# EAGLE design stripboard (EAGLE 6.1)
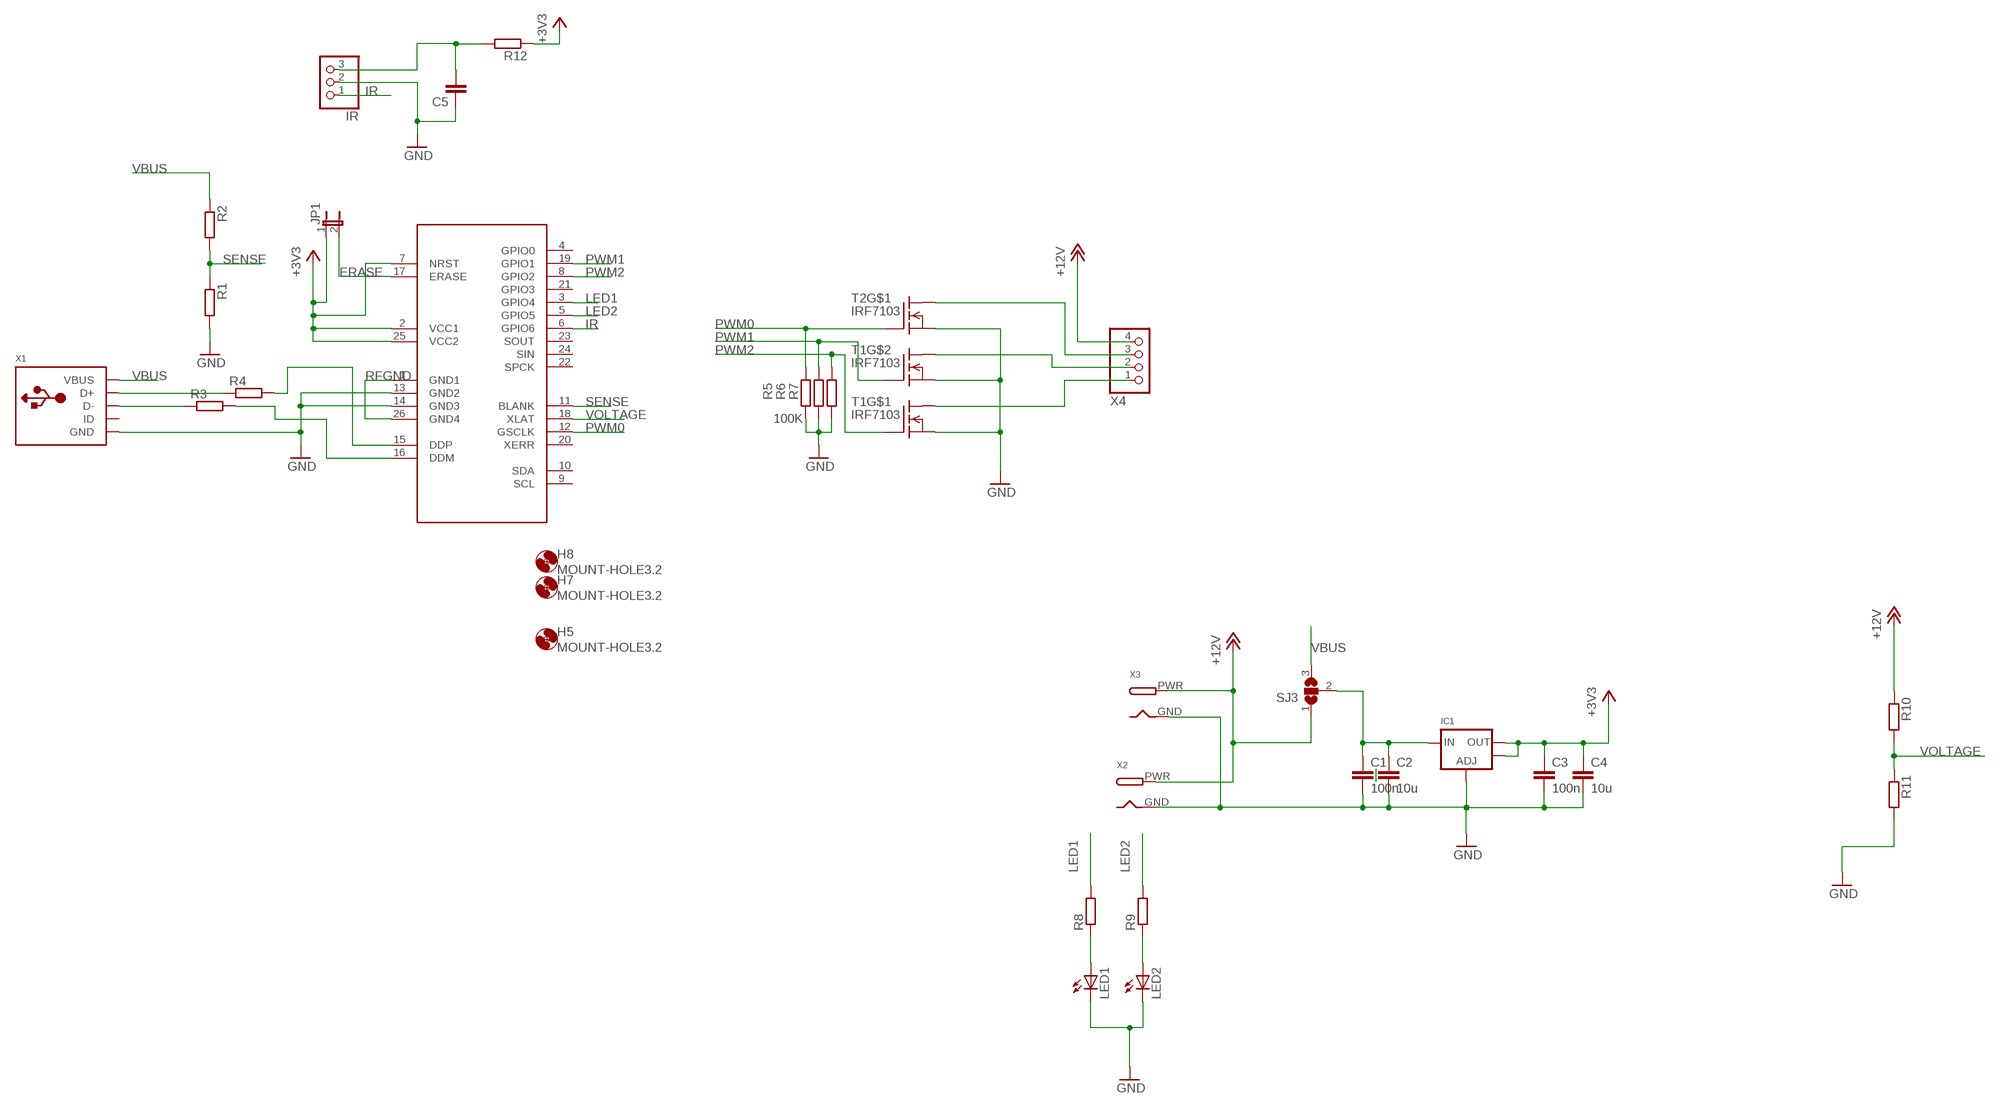
[diagram p0: schematic, sheet 1]

## Parts
C1  100n  C-EUC0805  [C0805]
C2  10u  C-EUC0805  [C0805]
C3  100n  C-EUC0805  [C0805]
C4  10u  C-EUC0805  [C0805]
C5  C-EUC0805  [C0805]
H5  MOUNT-HOLE3.2  [3,2]
H7  MOUNT-HOLE3.2  [3,2]
H8  MOUNT-HOLE3.2  [3,2]
IC1  LM1117SOT223-REFLOW  [SOT223-R]
IR  PINHD-1X3  [1X03]
JP1  JP1E  [JP1]
LED1  LEDCHIP-LED0805  [CHIP-LED0805]
LED2  LEDCHIP-LED0805  [CHIP-LED0805]
R1  R-EU_R0805  [R0805]
R2  R-EU_R0805  [R0805]
R3  R-EU_R0805  [R0805]
R4  R-EU_R0805  [R0805]
R5  100K  R-EU_M0805  [M0805]
R6  100K  R-EU_M0805  [M0805]
R7  100K  R-EU_M0805  [M0805]
R8  R-EU_R0805  [R0805]
R9  R-EU_R0805  [R0805]
R10  R-EU_R0805  [R0805]
R11  R-EU_R0805  [R0805]
R12  R-EU_R0805  [R0805]
SJ3  SJ2W  [SJ_2]
T1  IRF7103  [SO-8]
T2  IRF7103  [SO-8]
U$1  RFBOARD  [RFBOARD]
X1  USBMINIB  [USB-MINIB]
X2  DCBARRELPTH  [DCJACK_2MM_PTH]
X3  DCBARRELPTH  [DCJACK_2MM_PTH]
X4  PINHD-1X4/90  [1X04/90]

## Nets
+3V3: C3.1 C4.1 IC1.2(OUT) IC1.4(OUT1) JP1.1 R12.1 U$1.2(VCC1) U$1.7(NRST) U$1.25(VCC2)
+12V: R10.1 SJ3.1 X2.PWR X3.PWR X4.4
ERASE: JP1.2 U$1.17(ERASE)
GND: C1.2 C2.2 C3.2 C4.2 C5.1 IC1.1(ADJ) IR.2 LED1.C LED2.C R1.2 R5.2 R6.2 R7.2 R11.2 T1.1(S) T1.3(S) T2.1(S) U$1.13(GND2) U$1.14(GND3) X1.GND X2.GND X3.GND
IR: IR.1 U$1.6(GPIO6)
LED1: R8.2 U$1.3(GPIO4)
LED2: R9.2 U$1.5(GPIO5)
N$1: T1.8(D1) X4.1
N$4: T1.5(D1) X4.2
N$5: T2.8(D1) X4.3
N$47: LED1.A R8.1
N$48: LED2.A R9.1
N$49: R3.2 U$1.16(DDM)
N$55: R4.2 U$1.15(DDP)
N$60: R4.1 X1.D+
N$61: C1.1 C2.1 IC1.3(IN) SJ3.2
N$62: R3.1 X1.D-
N$65: C5.2 IR.3 R12.2
PWM0: R5.1 T2.2(G) U$1.12(GSCLK)
PWM1: R6.1 T1.4(G) U$1.19(GPIO1)
PWM2: R7.1 T1.2(G) U$1.8(GPIO2)
RFGND: U$1.1(GND1) U$1.26(GND4)
SENSE: R1.1 R2.2 U$1.11(BLANK)
VBUS: R2.1 SJ3.3 X1.VBUS
VOLTAGE: R10.2 R11.1 U$1.18(XLAT)
Unconnected: T1.6(D) T1.7(D) T2.3(S) T2.4(G) T2.5(D1) T2.6(D) T2.7(D) U$1.4(GPIO0) U$1.9(SCL) U$1.10(SDA) U$1.20(XERR) U$1.21(GPIO3) U$1.22(SPCK) U$1.23(SOUT) U$1.24(SIN) X1.ID

## Library data of the parts
C1-C5 = rcl:C-EU: CAPACITOR, European symbol
H5 H7 H8 = holes:MOUNT-HOLE: MOUNTING HOLE with drill center marker
IC1 = xtort:LM1117: LM1117 Voltage Regulator LM1117 Adjustable Voltage regulator [Digikey: LM1117IMP-ADJDKR-ND] LM1117 3.3V Voltage regulator [AP1117E33GDIDKR-ND] LM1117 5.0V Voltage regulator [AP1117E50GDIDKR-ND] SOT223-REFLOW - SOT223 package for solder paste/reflow ovens SOT223-WAVE - SOT223 package for hand-soldering (larger pads) Note: For the fixed-voltage regulators, simply set the ADJ pin to GND.
IR = pinhead:PINHD-1X3: PIN HEADER
JP1 = jumper:JP1E: JUMPER
LED1 LED2 = led:LED: LED OSRAM: - CHIPLED LG R971, LG N971, LY N971, LG Q971, LY Q971, LO R971, LY R971 LH N974, LH R974 LS Q976, LO Q976, LY Q976 LO Q996 - Hyper CHIPLED LW Q18S LB Q993, LB Q99A, LB R99A - SideLED LS A670, LO A670, LY A670, LG A670, LP A670 LB A673, LV A673, LT A673, LW A673 LH A674 LY A675 LS A676, LA A676, LO A676, LY A676, LW A676 LS A679, LY A679, LG A679 - Hyper Micro SIDELED® LS Y876, LA Y876, LO Y876, LY Y876 LT Y87S - SmartLED LW L88C, LW L88S LB L89C, LB L89S, LG L890 LS L89K, LO L89K, LY L89K LS L896, LA L896, LO L896, LY L896 - TOPLED LS T670, LO T670, LY T670, LG T670, LP T670 LSG T670, LSP T670, LSY T670, LOP T670, LYG T670 LG T671, LOG T671, LSG T671 LB T673, LV T673, LT T673, LW T673 LH T674 LS T676, LA T676, LO T676, LY T676, LB T676, LH T676, LSB T676, LW T676 LB T67C, LV T67C, LT T67C, LS T67K, LO T67K, LY T67K, LW E67C LS E67B, LA E67B, LO E67B, LY E67B, LB E67C, LV E67C, LT E67C LW T67C LS T679, LY T679, LG T679 LS T770, LO T770, LY T770, LG T770, LP T770 LB T773, LV T773, LT T773, LW T773 LH T774 LS E675, LA E675, LY E675, LS T675 LS T776, LA T776, LO T776, LY T776, LB T776 LHGB T686 LT T68C, LB T68C - Hyper Mini TOPLED® LB M676 - Mini TOPLED Santana® LG M470 LS M47K, LO M47K, LY M47K Source: http://www.osram.convergy.de LUXEON: - LUMILED® LXK2-PW12-R00, LXK2-PW12-S00, LXK2-PW14-U00, LXK2-PW14-V00 LXK2-PM12-R00, LXK2-PM12-S00, LXK2-PM14-U00 LXK2-PE12-Q00, LXK2-PE12-R00, LXK2-PE12-S00, LXK2-PE14-T00, LXK2-PE14-U00 LXK2-PB12-K00, LXK2-PB12-L00, LXK2-PB12-M00, LXK2-PB14-N00, LXK2-PB14-P00, LXK2-PB14-Q00 LXK2-PR12-L00, LXK2-PR12-M00, LXK2-PR14-Q00, LXK2-PR14-R00 LXK2-PD12-Q00, LXK2-PD12-R00, LXK2-PD12-S00 LXK2-PH12-R00, LXK2-PH12-S00 LXK2-PL12-P00, LXK2-PL12-Q00, LXK2-PL12-R00 Source: www.luxeon.com KINGBRIGHT: KA-3528ASYC Source: www.kingbright.com
R1-R12 = rcl:R-EU_: RESISTOR, European symbol
SJ3 = jumper:SJ2W: SMD solder JUMPER
T1 T2 = transistor-fet+irf7201:IRF7103
U$1 = xtort:RFBOARD
X1 = xtort:USB: USB Connectors USBMINIB - Surface Mount Female Mini-B USB Connector 4UConnector: 06564
X2 X3 = xtort:DCBARREL: DC Barrel Jack DCJACK_1.3MM_PTH - Through Hole 1.3mm Jack (4UConnector: 05536) DCJACK_2MM_PTH - Through Hole 2.0/2.1 Jack (4UConnector: 05537) DCJACK_2MM_SMT - SMT 2.0/2.1mm Jack(4UConnector: 03267)
X4 = pinhead:PINHD-1X4: PIN HEADER

## Board
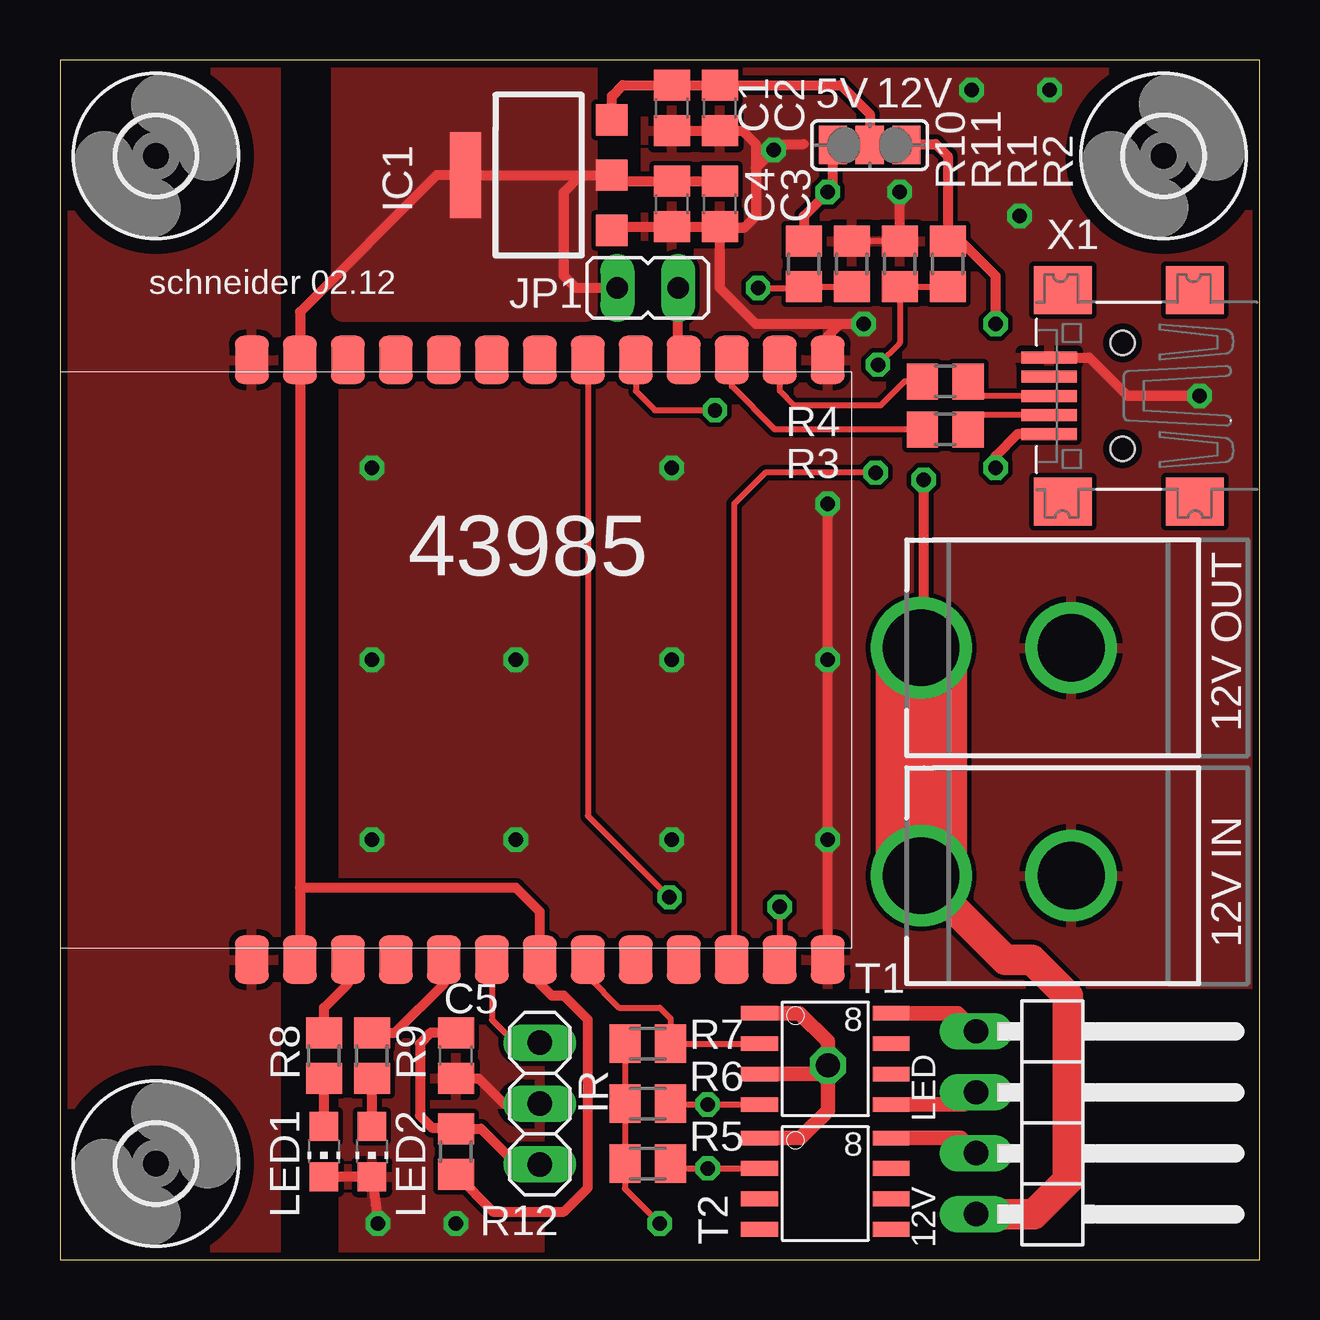
[diagram p1: board, top side]
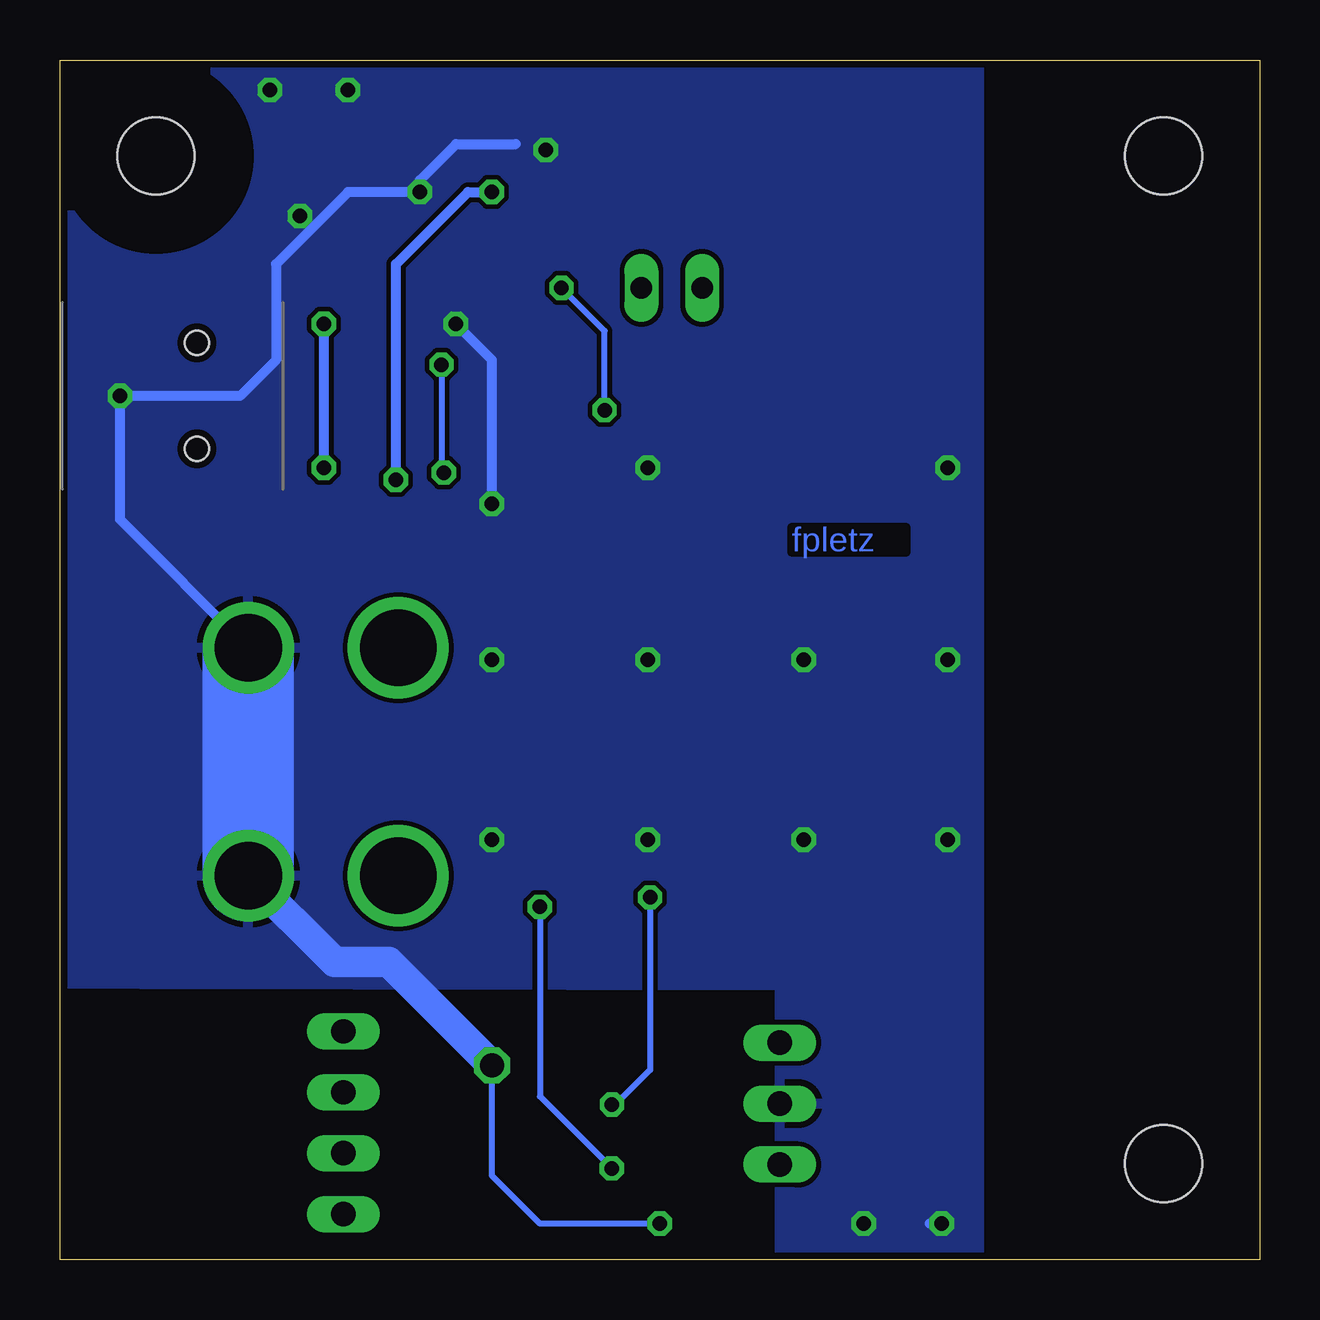
[diagram p2: board, bottom side, seen from below]

Size 50 x 50 mm. Coordinates in mm from the lower left corner, seen from the top.
Outline: 0,0 50,0 50,50 0,50 0,0
Copper layers (1*16): Top 0.035mm / dielectric 1.5mm / Bottom 0.035mm
Design rules: minimum track width 0.2mm, minimum drill 0.3mm, track to track 0.2mm, track to pad 0.2mm, pad to pad 0.2mm, via to via 0.2mm, smd to smd 0.2mm, copper to edge 0.3mm, drill to drill 8mil, minimum pad ring 10mil, minimum via ring 8mil, stop-mask expansion 4mil, vias tented up to drill 0.6mm, thermal gap 10mil

### Footprints (pad centres in the part's own frame; a part is rotated, then mirrored left to right if it is on the bottom)
C0805 = smd 1.3 x 1.5: 1 -0.95,0; 2 0.95,0
3,2 = hole 3.2: 0,0
SOT223-R = smd 1.3 x 1.3: 1 -2.3,-3.05; 2 0,-3.05; 3 2.3,-3.05 | smd 3.6 x 1.3: 4 0,3.05
1X03 = drill 1.016 long: 1 -2.54,0; 2 0,0; 3 2.54,0
JP1 = drill 0.914 long: 1 0,-1.27; 2 0,1.27
CHIP-LED0805 = smd 1.2 x 1.2: A 0,-1.05; C 0,1.05
R0805 = smd 1.3 x 1.5: 1 -0.95,0; 2 0.95,0
M0805 = smd 1.3 x 1.6: 1 -0.95,0; 2 0.95,0
SJ_2 = smd 1.168 x 1.6: 1 -1.524,0; 2 0,0; 3 1.524,0
SO-8 = smd 1.524 x 0.61: 1 -2.743,1.27; 2 -2.743,0; 3 -2.743,-1.27; 4 -2.743,-2.54; 5 2.743,-2.54; 6 2.743,-1.27; 7 2.743,0; 8 2.743,1.27
RFBOARD = smd 2 x 1.4: 1 -12.5,8; 2 -12.5,6; 3 -12.5,4; 4 -12.5,2; 5 -12.5,0; 6 -12.5,-2; 7 -12.5,-4; 8 -12.5,-6; 9 -12.5,-8; 10 -12.5,-10; 11 -12.5,-12; 12 -12.5,-14; 13 -12.5,-16; 14 12.5,-16; 15 12.5,-14; 16 12.5,-12; 17 12.5,-10; 18 12.5,-8; 19 12.5,-6; 20 12.5,-4; 21 12.5,-2; 22 12.5,0; 23 12.5,2; 24 12.5,4; 25 12.5,6; 26 12.5,8
USB-MINIB = smd 0.5 x 2.308: D+ 0,4.064; D- -0.8,4.064; GND 1.6,4.064; ID 0.8,4.064; VBUS -1.6,4.064 | smd 2 x 2.4: GND1 -4.4,-2; GND2 -4.4,3.5; GND3 4.4,3.5; GND4 4.4,-2 | hole 1: -2.2,1; 2.2,1
DCJACK_2MM_PTH = drill 2.8: GND 0,7.35 | drill 3.2: PWR 0,13.6
1X04/90 = drill 1.016 long: 1 -3.81,-3.81; 2 -1.27,-3.81; 3 1.27,-3.81; 4 3.81,-3.81

### Placement (x,y rotation side)
C1  25.5,48 270 top
C2  27.5,48 270 top
C3  27.5,44 270 top
C4  25.5,44 270 top
C5  16.5,8.5 90 top
H5  4,4 0 top
H7  4,46 0 top
H8  46,46 0 top
IC1  19.95,45.2 90 top
IR  20,6.5 270 top
JP1  24.5,40.5 270 top
LED1  11,4.5 180 top
LED2  13,4.5 180 top
R1  35,41.5 90 top
R2  37,41.5 270 top
R3  36.9,34.6 180 top
R4  36.9,36.6 180 top
R5  24.5,4 180 top
R6  24.5,6.5 180 top
R7  24.5,9 180 top
R8  11,8.5 90 top
R9  13,8.5 90 top
R10  31,41.5 270 top
R11  33,41.5 90 top
R12  16.5,4.5 90 top
SJ3  33.75,46.45 0 top
T1  31.9,9 0 top
T2  31.9,3.8 0 top
U$1  16,25 90 top
X1  45.3,36 90 top
X2  49.5,25.5 90 top
X3  49.5,16 90 top
X4  42,5.7 270 top

### Tracks (layer width: path | path; a pad name or v marks a point on that pad's centre or on a via)
+3V3
  Top 0.406: R12.1 18.05,2 21,2 22,3 22,10 21,11 20.5,11 20,11.5 U$1.7 20,14.5 19,15.5 10,15.5 | C3.1 C4.1 23.25,44.95 IC1.2 21.7,45.2 | JP1.1 21.5,40.5 21,41 21,44.5 21.7,45.2 | 21.7,45.2 IC1.4 15.7,45.2 10,39.5 U$1.25 10,15.5 | 10,15.5 U$1.2
  pour Top (no thermals): 21.9,39.6 11.8,39.6 11.8,59.6 21.9,59.6
+12V  (via drill 0.6)
  Top 0.406: X2.PWR 36,25.6 v36,32.5 | R10.1 31,43.5 v32,44.5 32.23,44.73 SJ3.1
  Top 1.27: X4.4 40.59,1.89 42,3.3 42,11 40.5,12.5 39.4,12.5 X3.PWR
  Top 3.81: X3.PWR X2.PWR
  Bottom 0.406: v36,32.5 36,41.5 33,44.5 v32,44.5
ERASE
  Top 0.406: U$1.17 25.77,37.73 JP1.2
GND  (via drill 0.6, 1)
  Top 0.254: R1.2 R11.2 | R7.2 R6.2 R5.2 23.55,2.95 v25,1.5
  Top 0.406: C5.1 17.45,7.55 18.5,6.5 IR.2 | LED1.C LED2.C v13.25,1.5 | v47.5,36 44.5,36 42.9,37.6 X1.GND | U$1.13 v32,31.5 | v33.5,39 32.5,39 | 32.5,39 32,38.5 U$1.14 | 32.5,39 29,39 27.5,40.5 C3.2 | C1.2 C2.2 28.45,47.05 29,46.5 29,45.5 | IC1.1 23.15,43.05 C4.2 C3.2 | 29,45.5 29,43.5 28.5,43 27.55,43 C3.2 | R1.2 v35,44.5 | 29,45.5 v29.75,46.25 30,46.5 31,46.5
  Top 0.61: T1.3 31.63,7.73 v32,8.1 | T2.1 30.87,5.07 32,6.2 v32,8.1 | T1.1 30.83,10.27 32,9.1 v32,8.1
  Bottom 0.254: v25,1.5 30,1.5 32,3.5 v32,8.1
  Bottom 0.406: v13.25,1.5 13.75,1.5 | X2.GND 47.5,30.85 v47.5,36 42.5,36 41,37.5 41,41.5 38,44.5 v35,44.5 35,45 33.5,46.5 31,46.5 | v32,31.5 U$1.14 v33.5,39
  Bottom 1.27: X3.GND 38.55,12.4 36.3,12.4 v32,8.1
  Bottom 3.81: X2.GND X3.GND
  other vias: 13,33 13,25 13,17.5 19,17.5 25.5,17.5 25.5,33 32,17.5 38,48.75 41.25,48.75 40,43.5 25.5,25 32,25 16.5,1.5 19,25
  pour Bottom: 11.7,50.5 11.7,-1.9 20,-2 20,11.4 55.6,11.5 55.6,51.5 40.8,51.5
  pour Top: 24.4,51.5 24.4,37.4 11.8,37.4 11.8,-2 20,-2 20,11.5 53.9,11.5 53.9,53.9 45.8,53.9
IR
  Top 0.254: U$1.6 18,10 18.96,9.04 IR.1
LED1
  Top 0.406: R8.2 11,10.5 12,11.5 U$1.3
LED2
  Top 0.406: R9.2 13.95,9.45 16,11.5 U$1.5
N$1
  Top 0.61: T1.8 37.43,10.27 X4.1
N$4
  Top 0.61: T1.5 37.68,6.46 X4.2
N$5
  Top 0.61: T2.8 37.55,5.07 X4.3
N$47
  Top 0.406: LED1.A R8.1
N$48
  Top 0.406: LED2.A R9.1
N$49
  Top 0.254: R3.2 29.8,34.6 28,36.4 U$1.16
N$55
  Top 0.254: R4.2 35.2,36.6 34.2,35.6 30.6,35.6 30,36.2 U$1.15
N$60
  Top 0.254: X1.D+ 38.45,36 R4.1
N$61
  Top 0.406: IC1.3 23,48.5 23.45,48.95 C1.1 C2.1 32.55,48.95 33.75,47.75 SJ3.2
N$62
  Top 0.254: X1.D- 38.45,35.2 R3.1
N$65
  Top 0.406: C5.2 15.45,9.45 15,9 15,6 15.5,5.5 16.45,5.5 R12.2 17.55,5.45 19.04,3.96 IR.3
PWM0  (via drill 0.6)
  Top 0.254: U$1.12 v30,14.7 | R5.1 25.65,3.8 26.5,3.8 v27,3.8 T2.2
  Bottom 0.254: v30,14.7 30,6.8 v27,3.8
PWM1  (via drill 0.6)
  Top 0.254: U$1.19 22,18.5 v25.4,15.1 | R6.1 25.49,6.46 v26.99,6.46 T1.4
  Bottom 0.254: v25.4,15.1 25.4,7.9 26.84,6.46 v26.99,6.46
PWM2
  Top 0.254: U$1.8 22,11.8 23.3,10.5 25,10.5 25.45,10.05 R7.1 T1.2
RFGND
  pour Top: 9,35 9,51 -2,51 -2,-4 2,-4 9,-4
SENSE  (via drill 0.6)
  Top 0.254: R2.2 R1.1 35,38.2 v34.1,37.3 | v34,32.8 29.4,32.8 28.1,31.5 28.1,12.6 U$1.11
  Bottom 0.254: v34.1,37.3 34.1,32.9 v34,32.8
VBUS  (via drill 0.6)
  Top 0.406: X1.VBUS 39.9,34.4 39,33.5 v39,33 | v39,39 39,41 37.55,42.45 R2.1 37,46 36.5,46.5 35.32,46.5 SJ3.3
  Bottom 0.406: v39,33 v39,39
VOLTAGE  (via drill 0.6)
  Top 0.254: R11.1 R10.2 30.95,40.5 v29.1,40.5 | U$1.18 24,36.2 24.8,35.4 v27.3,35.4
  Bottom 0.254: v27.3,35.4 27.3,38.7 v29.1,40.5

### Text on the board
Bottom: fpletz
tPlace: 5V | 12V | schneider 02.12 | 43985 | 12V OUT | 12V IN | LED | 12V